# Altium schematic sheet pca20017_misc.SchDoc: nRF52 Quadcopter - Misc
size A4; Organization: Nordic Semiconductor; DocumentNumber: 2; Revision: 1.0.0; SheetNumber: 2; SheetTotal: 5; CompanyName: Nordic Semiconductor; DrawnBy: ERHE; ProjectNumber: 4425; DocumentSize: A4; PCBRevision: 0002ERHE; PCAName: PCA20017; PCBNumber: 400151; Rule: PcbType=ProtelPcb
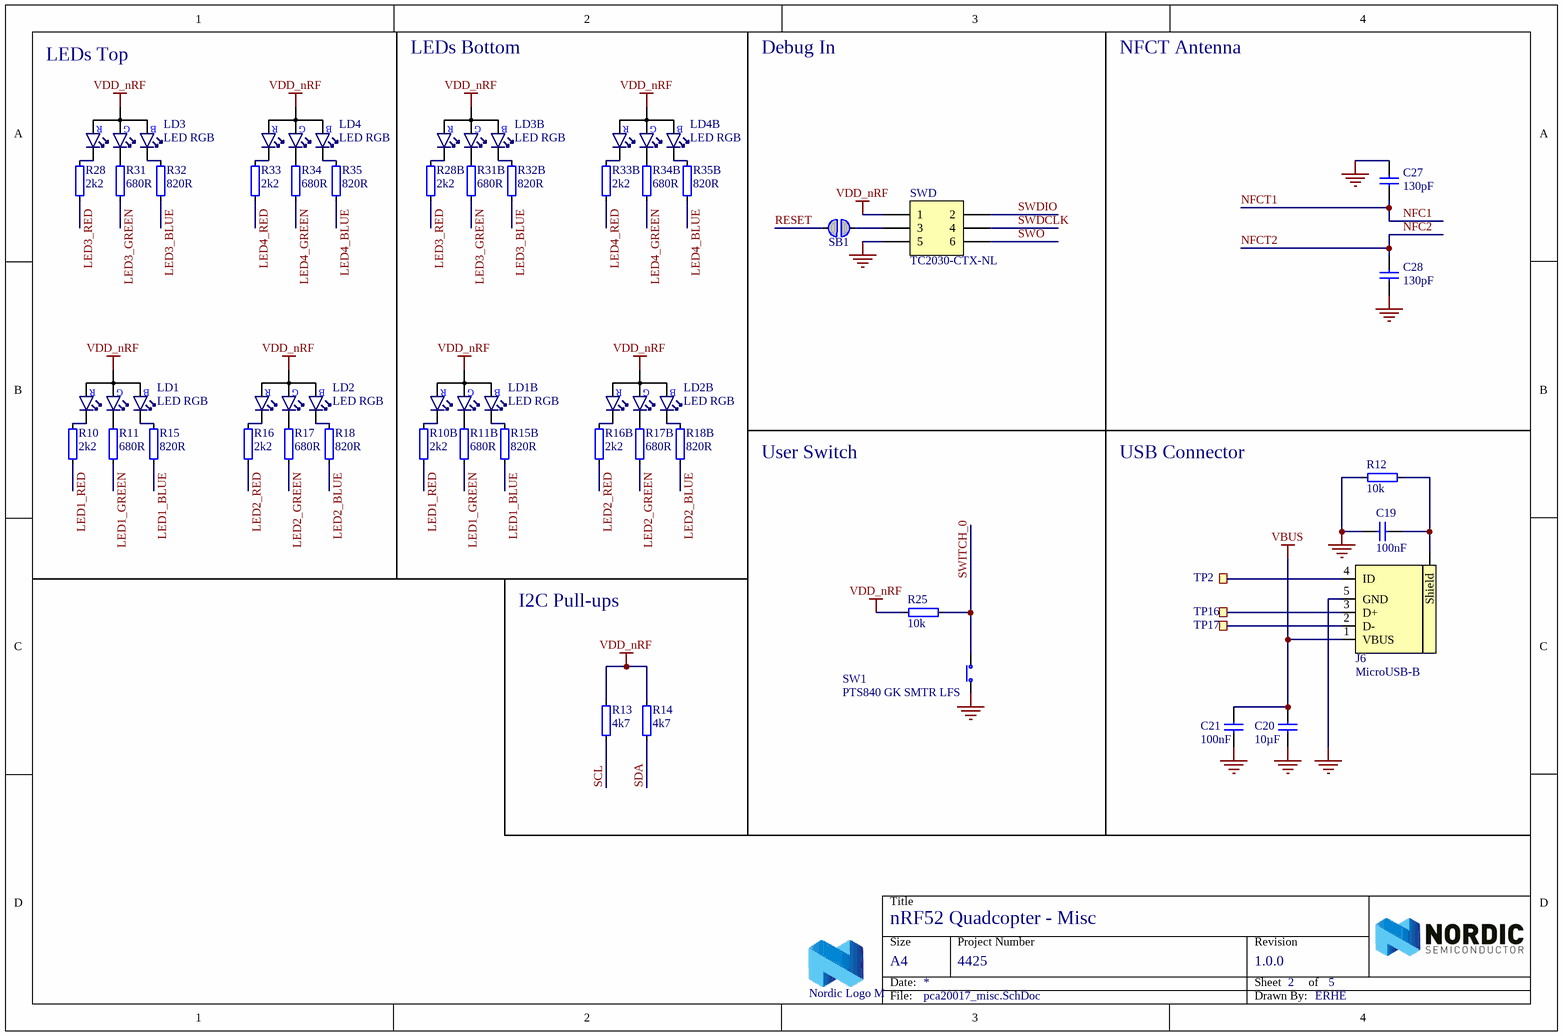
[diagram p0: pca20017_misc.SchDoc]

## Parts
C19  100nF  [CAPC1005X04L]
C20  10µF  [CAPC1608X06L]
C21  100nF  [CAPC1005X04L]
C27  130pF  [CAPC1005X04L]
C28  130pF  [CAPC1005X04L]
J6  MicroUSB-B  [USB-Micro-B-RA-SMD-PiP]
LD1  LED RGB  [SML-LX0404SIUPGUSB]
LD1B  LED RGB  [SML-LX0404SIUPGUSB]
LD2  LED RGB  [SML-LX0404SIUPGUSB]
LD2B  LED RGB  [SML-LX0404SIUPGUSB]
LD3  LED RGB  [SML-LX0404SIUPGUSB]
LD3B  LED RGB  [SML-LX0404SIUPGUSB]
LD4  LED RGB  [SML-LX0404SIUPGUSB]
LD4B  LED RGB  [SML-LX0404SIUPGUSB]
LOGO1  Nordic Logo M  [NORDIC_LOGO_M]  (no BOM)
R10  2k2  [RESC1005X04L]
R10B  2k2  [RESC1005X04L]
R11  680R  [RESC1005X04L]
R11B  680R  [RESC1005X04L]
R12  10k  [RESC1005X04L]
R13  4k7  [RESC1005X04L]
R14  4k7  [RESC1005X04L]
R15  820R  [RESC1005X04L]
R15B  820R  [RESC1005X04L]
R16  2k2  [RESC1005X04L]
R16B  2k2  [RESC1005X04L]
R17  680R  [RESC1005X04L]
R17B  680R  [RESC1005X04L]
R18  820R  [RESC1005X04L]
R18B  820R  [RESC1005X04L]
R25  10k  [RESC1005X04L]
R28  2k2  [RESC1005X04L]
R28B  2k2  [RESC1005X04L]
R31  680R  [RESC1005X04L]
R31B  680R  [RESC1005X04L]
R32  820R  [RESC1005X04L]
R32B  820R  [RESC1005X04L]
R33  2k2  [RESC1005X04L]
R33B  2k2  [RESC1005X04L]
R34  680R  [RESC1005X04L]
R34B  680R  [RESC1005X04L]
R35  820R  [RESC1005X04L]
R35B  820R  [RESC1005X04L]
SB1  Solderbridge  [Solderbridge]  (value not drawn)  (no BOM)
SW1  PTS840 GK SMTR LFS  [EVQP7A/J/B/K]
SWD  TC2030-CTX-NL  [TC2030-IDC-NLFP]  (no BOM)
TP2  Ø1.0mm,SMD  [TP_SMD_Ø1.0mm]  (value not drawn)  (no BOM)
TP16  Ø1.0mm,SMD  [TP_SMD_Ø1.0mm]  (value not drawn)  (no BOM)
TP17  Ø1.0mm,SMD  [TP_SMD_Ø1.0mm]  (value not drawn)  (no BOM)

## Nets
GND: C19.1 C20.1 C21.1 C27.2 C28.1 J6.5(GND) R12.1 SW1.2(COM) SWD.5
VBUS: C20.2 C21.2 J6.1(VBUS)
VDD_nRF: LD1.4(A) LD1B.4(A) LD2.4(A) LD2B.4(A) LD3.4(A) LD3B.4(A) LD4.4(A) LD4B.4(A) R13.2 R14.2 R25.1 SWD.1
LED1_BLUE: R15.1 R15B.1
LED1_GREEN: R11.1 R11B.1
LED1_RED: R10.1 R10B.1
LED2_BLUE: R18.1 R18B.1
LED2_GREEN: R17.1 R17B.1
LED2_RED: R16.1 R16B.1
LED3_BLUE: R32.1 R32B.1
LED3_GREEN: R31.1 R31B.1
LED3_RED: R28.1 R28B.1
LED4_BLUE: R35.1 R35B.1
LED4_GREEN: R34.1 R34B.1
LED4_RED: R33.1 R33B.1
NFC1: C27.1  [also labelled NFCT1]
NFC2: C28.2  [also labelled NFCT2]
RESET: SB1.2
SCL: R13.1
SDA: R14.1
SWDCLK: SWD.4
SWDIO: SWD.2
SWITCH_0: R25.2 SW1.1(N.O)
SWO: SWD.6
NetC19_2: C19.2 J6.6(Shield) R12.2
NetJ6_2: J6.2(D-) TP17.1
NetJ6_3: J6.3(D+) TP16.1
NetJ6_4: J6.4(ID) TP2.1
NetLD1_1: LD1.1(C_RED) R10.2
NetLD1_2: LD1.2(C_GREEN) R11.2
NetLD1_3: LD1.3(C_BLUE) R15.2
NetLD1B_1: LD1B.1(C_RED) R10B.2
NetLD1B_2: LD1B.2(C_GREEN) R11B.2
NetLD1B_3: LD1B.3(C_BLUE) R15B.2
NetLD2_1: LD2.1(C_RED) R16.2
NetLD2_2: LD2.2(C_GREEN) R17.2
NetLD2_3: LD2.3(C_BLUE) R18.2
NetLD2B_1: LD2B.1(C_RED) R16B.2
NetLD2B_2: LD2B.2(C_GREEN) R17B.2
NetLD2B_3: LD2B.3(C_BLUE) R18B.2
NetLD3_1: LD3.1(C_RED) R28.2
NetLD3_2: LD3.2(C_GREEN) R31.2
NetLD3_3: LD3.3(C_BLUE) R32.2
NetLD3B_1: LD3B.1(C_RED) R28B.2
NetLD3B_2: LD3B.2(C_GREEN) R31B.2
NetLD3B_3: LD3B.3(C_BLUE) R32B.2
NetLD4_1: LD4.1(C_RED) R33.2
NetLD4_2: LD4.2(C_GREEN) R34.2
NetLD4_3: LD4.3(C_BLUE) R35.2
NetLD4B_1: LD4B.1(C_RED) R33B.2
NetLD4B_2: LD4B.2(C_GREEN) R34B.2
NetLD4B_3: LD4B.3(C_BLUE) R35B.2
NetSB1_1: SB1.1 SWD.3

## Notes on the sheet
- LEDs Top
- LEDs Bottom
- Debug In
- NFCT Antenna
- User Switch
- USB Connector
- I2C Pull-ups
- Title
- Size
- Date:
- Project Number
- Sheet         of
- Revision
- File:
- Drawn By:
- (in symbol SML-LX0404SIUPGUSB) R; G; B

## Library data of the parts
C19 C21 = C0402-100n: Capacitor, X7R, ±10%; Note: 16V; Artikkelnr Noca: 20039200; Artikkelnr Simpro: N.A.; Part Number: C0402-100n; Manufacturer: *; Manufacturer Part Number: *; Datasheet: *; LatestRevisionDate: 2009-11-23; Pin Count: 2; Publisher: Nordic Semiconductor; Published: 2009-05-08; Value: 100nF; Supplier: *; Supplier part number: *; 2nd source Supplier: *; 2nd source part number: *; Footprint Doc: 0402
C20 = C0603-10µ: Capacitor, X5R, ±20%; Note: 6.3V; Artikkelnr Noca: 20039234; Artikkelnr Simpro: N.A.; Part Number: C0603-10µ; Manufacturer: *; Manufacturer Part Number: *; Datasheet: *; LatestRevisionDate: 2011-01-17; Pin Count: 2; Publisher: Nordic Semiconductor; Published: 2011-01-17; Value: 10µF; Supplier: *; Supplier part number: *; 2nd source Supplier: *; 2nd source part number: *; Footprint Doc: 0603
C27 C28 = C0402-130p: Chip Cap 0402; Note: Chip Cap 1%; Artikkelnr Noca: N.A.; Part Number: C0402-130p; Manufacturer: *; Manufacturer Part Number: *; Datasheet: *; Footprint Doc: 0402; LatestRevisionDate: 2015-04-24; Pin Count: 2; Publisher: Nordic Semiconductor; Published: 2015-04-24; Value: 130pF; Supplier: *; Supplier part number: *; 2nd source Supplier: *; 2nd source part number: *; Artikkelnr Simpro: N.A.
J6 = USB-Micro-B-RA-SMD-PiP: MicroUSB-B-SMT; Manufacturer: Allen Creations Corp.; Manufacturer Part Number: AJU55-BS2111-L; 2nd source part number: 609-4616-1-ND; Artikkelnr Noca: 55029020; Artikkelnr Simpro: N.A.; Part Number: USB-Micro-B-RA-SMD-PiP; Datasheet: \\hizz\pro\app9717\Datasheet\connectores\Allen Creations Corp\AJU-211.pdf; Footprint Doc: USB-Micro-B-RA-SMD-PiP; LatestRevisionDate: 2016-04-21; Pin Count: 5; Publisher: Nordic Semiconductor; Published: 2014-10-07; Value: MicroUSB-B; Note: *; Supplier: Cabcon; Supplier part number: AJU55-BS2111-L; 2nd source Supplier: Digi-Key
LD1 LD1B LD2 LD2B LD3 LD3B LD4 LD4B = SML-LX0404SIUPGUSB: RGB LED 1.00 mm x 1.00 mm SMD; Manufacturer: Lumex; 2nd source part number: 211-8843; Artikkelnr Noca: 13019150; Artikkelnr Simpro: N.A.; Part Number: SML-LX0404SIUPGUSB; Manufacturer Part Number: SML-LX0404SIUPGUSB; Datasheet: http://media.digikey.com/pdf/Data%20Sheets/Lumex%20PDFs/SML-LX0404SIUPGUSB.pdf; Footprint Doc: SML-LX0404SIUPGUSB; LatestRevisionDate: 2012-10-08; Pin Count: 4; Publisher: Nordic Semiconductor; Published: 2012-10-08; Value: LED RGB; Note: *; Supplier: Digi-Key; Supplier part number: 67-2125-1-ND; 2nd source Supplier: Farnell
LOGO1 = Nordic Logo M: Nordic Logo, medium size; Artikkelnr Noca: N.A.; Part Number: Nordic Logo M; Manufacturer: *; Manufacturer Part Number: *; Datasheet: *; LatestRevisionDate: 2010-02-18; Publisher: Nordic Semiconductor; Value: Nordic Logo M; Note: *; Supplier: *; Supplier part number: *; 2nd source Supplier: *; 2nd source part number: *; Pin Count: 2; Published: 2010-02-18; Footprint Doc: NORDIC_LOGO_M; Artikkelnr Simpro: N.A.
R10 R10B R16 R16B R28 R28B R33 R33B = R0402-2k2: Resistor, ±1%, 0.063W; Note: Chip Res 1%; Artikkelnr Noca: 27049081; Artikkelnr Simpro: N.A.; Value Ohm: 2200; Part Number: R0402-2k2; Manufacturer: *; Manufacturer Part Number: *; Datasheet: *; Footprint Doc: 0402; LatestRevisionDate: 2009-11-23; Pin Count: 2; Publisher: Nordic Semiconductor; Published: 2009-05-08; Value: 2k2; Supplier: Farnell; Supplier part number: 173-8854; 2nd source Supplier: *; 2nd source part number: *
R11 R11B R17 R17B R31 R31B R34 R34B = R0402-680: Resistor, ±1%, 0.063W; Note: Chip Res 1%; Artikkelnr Noca: 27049069; Artikkelnr Simpro: N.A.; Value Ohm: 680; Part Number: R0402-680; Manufacturer: *; Manufacturer Part Number: *; Datasheet: *; Footprint Doc: 0402; LatestRevisionDate: 2009-11-23; Pin Count: 2; Publisher: Nordic Semiconductor; Published: 2009-05-08; Value: 680R; Supplier: Farnell; Supplier part number: 173-8848; 2nd source Supplier: *; 2nd source part number: *
R12 R25 = R0402-10k: Resistor, ±1%, 0.063W; Note: Chip Res 1%; Artikkelnr Noca: 27049097; Artikkelnr Simpro: N.A.; Value Ohm: 10000; Value: 10k; Part Number: R0402-10k; Manufacturer: *; Manufacturer Part Number: *; Datasheet: *; LatestRevisionDate: 2009-11-23; Pin Count: 2; Publisher: Nordic Semiconductor; Published: 2009-05-08; Supplier: Farnell; Supplier part number: 173-8864; 2nd source Supplier: *; 2nd source part number: *; Footprint Doc: 0402
R13 R14 = R0402-4k7: Resistor, ±1%, 0.063W; Note: Chip Res 1%; Artikkelnr Noca: 27049089; Artikkelnr Simpro: N.A.; Value Ohm: 4700; Part Number: R0402-4k7; Manufacturer: *; Manufacturer Part Number: *; Datasheet: *; Footprint Doc: 0402; LatestRevisionDate: 2009-11-23; Pin Count: 2; Publisher: Nordic Semiconductor; Published: 2009-05-08; Value: 4k7; Supplier: Farnell; Supplier part number: 173-8858; 2nd source Supplier: *; 2nd source part number: *
R15 R15B R18 R18B R32 R32B R35 R35B = R0402-820: Resistor, ±1%, 0.063W; Note: Chip Res 1%; Artikkelnr Noca: 27049071; Artikkelnr Simpro: N.A.; Value Ohm: 820; Part Number: R0402-820; Manufacturer: *; Manufacturer Part Number: *; Datasheet: *; Footprint Doc: 0402; LatestRevisionDate: 2009-11-23; Pin Count: 2; Publisher: Nordic Semiconductor; Published: 2009-05-08; Value: 820R; Supplier: Farnell; Supplier part number: 173-8849; 2nd source Supplier: *; 2nd source part number: *
SB1 = Solderbridge: Artikkelnr Noca: N.A.; Part Number: Solderbridge; Manufacturer: *; Manufacturer Part Number: *; Datasheet: *; Footprint Doc: Solderbridge; LatestRevisionDate: 2009-12-14; Pin Count: 2; Publisher: Nordic Semiconductor; Published: 2009-12-14; Value: Solderbridge; Note: *; Supplier: *; Supplier part number: *; 2nd source Supplier: *; 2nd source part number: *; Artikkelnr Simpro: N.A.
SW1 = PTS840 GK SMTR LFS: Microminiature SMT Switch, Side Actuated; Manufacturer: C & K; 2nd source part number: 611-PTS840GKSMTR; Note: Tactile Switch, SPST, SMD, 220gf; Artikkelnr Noca: 50019089; Artikkelnr Simpro: N.A.; Part Number: PTS840 GK SMTR LFS; Manufacturer Part Number: PTS840 GK SMTR LFS; Datasheet: http://www.ck-components.com/80185/pts840_11june13.pdf/; Footprint Doc: PTS840 Gx; LatestRevisionDate: 2014-09-17; Pin Count: 4; Publisher: Nordic Semiconductor; Published: 2014-08-12; Value: PTS840 GK SMTR LFS; Supplier: Digi-Key; Supplier part number: CKN10508CT-ND; 2nd source Supplier: Mouser
SWD = TC2030-CTX-NL: CBL PLUG-OF-NAILS 6-PIN; Manufacturer: Tag-Connect LLC; Artikkelnr Noca: N.A.; Part Number: TC2030-CTX-NL; Manufacturer Part Number: TC2030-CTX-NL; Datasheet: http://www.tag-connect.com/Materials/TC2030-IDC-NL.pdf; Footprint Doc: TC2030-IDC-NLFP; LatestRevisionDate: 2013-08-08; Pin Count: 6; Publisher: Nordic Semiconductor; Published: 2013-08-08; Value: TC2030-CTX-NL; Supplier: Tag-Connect; Supplier part number: TC2030-CTX-NL; 2nd source Supplier: *; 2nd source part number: *; Artikkelnr Simpro: N.A.
TP2 TP16 TP17 = TP_SMD_Ø1.0MM: 1.0mm circular SMD testpad; Manufacturer: Nordic Semiconductor; Artikkelnr Noca: N.A.; Part Number: TP_SMD_Ø1.0MM; Manufacturer Part Number: *; Datasheet: *; Footprint Doc: TP_SMD_Ø1.0mm; LatestRevisionDate: 2013-06-11; Pin Count: 1; Publisher: Nordic Semiconductor; Published: 2013-06-11; Value: Ø1.0mm,SMD; Note: *; Supplier: *; Supplier part number: *; 2nd source Supplier: *; 2nd source part number: *; Artikkelnr Simpro: N.A.